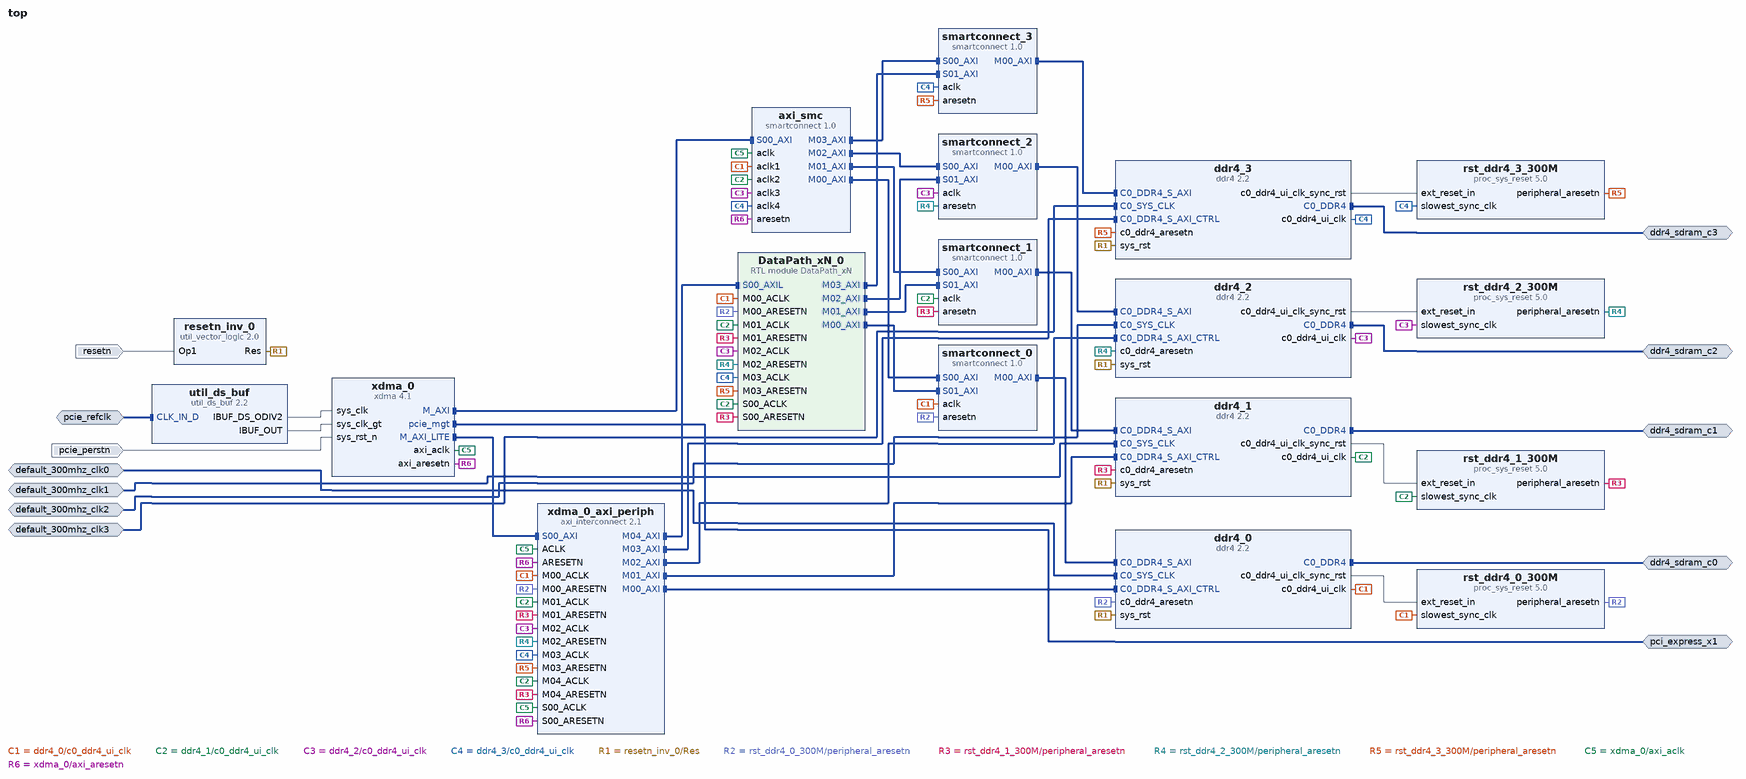
[diagram p0: block diagram of the top level]
# Vivado block design top, xcu250-figd2104-2L-e, Vivado 2022.2
create_bd_design top

create_bd_intf_port -mode Master -vlnv xilinx.com:interface:pcie_7x_mgt_rtl:1.0 pci_express_x1
create_bd_intf_port -mode Slave -vlnv xilinx.com:interface:diff_clock_rtl:1.0 pcie_refclk
set_property -dict {CONFIG.FREQ_HZ 100000000} [get_bd_intf_ports pcie_refclk]
create_bd_intf_port -mode Master -vlnv xilinx.com:interface:ddr4_rtl:1.0 ddr4_sdram_c0
create_bd_intf_port -mode Slave -vlnv xilinx.com:interface:diff_clock_rtl:1.0 default_300mhz_clk0
set_property -dict {CONFIG.FREQ_HZ 300000000} [get_bd_intf_ports default_300mhz_clk0]
create_bd_intf_port -mode Master -vlnv xilinx.com:interface:ddr4_rtl:1.0 ddr4_sdram_c1
create_bd_intf_port -mode Slave -vlnv xilinx.com:interface:diff_clock_rtl:1.0 default_300mhz_clk1
set_property -dict {CONFIG.FREQ_HZ 300000000} [get_bd_intf_ports default_300mhz_clk1]
create_bd_intf_port -mode Master -vlnv xilinx.com:interface:ddr4_rtl:1.0 ddr4_sdram_c2
create_bd_intf_port -mode Slave -vlnv xilinx.com:interface:diff_clock_rtl:1.0 default_300mhz_clk2
set_property -dict {CONFIG.FREQ_HZ 300000000} [get_bd_intf_ports default_300mhz_clk2]
create_bd_intf_port -mode Master -vlnv xilinx.com:interface:ddr4_rtl:1.0 ddr4_sdram_c3
create_bd_intf_port -mode Slave -vlnv xilinx.com:interface:diff_clock_rtl:1.0 default_300mhz_clk3
set_property -dict {CONFIG.FREQ_HZ 300000000} [get_bd_intf_ports default_300mhz_clk3]
create_bd_port -dir I -type rst pcie_perstn
set_property -dict {CONFIG.POLARITY ACTIVE_LOW} [get_bd_ports pcie_perstn]
create_bd_port -dir I -type rst resetn
set_property -dict {CONFIG.POLARITY ACTIVE_LOW} [get_bd_ports resetn]

create_bd_cell -type ip -vlnv xilinx.com:ip:xdma:4.1 xdma_0
set_property -dict [list \
  CONFIG.PCIE_BOARD_INTERFACE pci_express_x1 \
  CONFIG.SYS_RST_N_BOARD_INTERFACE pcie_perstn \
  CONFIG.axilite_master_en true \
  CONFIG.axilite_master_size 1 \
  CONFIG.pciebar2axibar_axil_master 0x00000000 \
  CONFIG.pl_link_cap_max_link_speed 2.5_GT/s \
  CONFIG.xdma_axi_intf_mm AXI_Memory_Mapped \
  CONFIG.xdma_rnum_chnl 1 \
  CONFIG.xdma_wnum_chnl 1 \
] [get_bd_cells xdma_0]
create_bd_cell -type ip -vlnv xilinx.com:ip:util_ds_buf:2.2 util_ds_buf
set_property -dict {CONFIG.DIFF_CLK_IN_BOARD_INTERFACE pcie_refclk CONFIG.USE_BOARD_FLOW true} [get_bd_cells util_ds_buf]
create_bd_cell -type ip -vlnv xilinx.com:ip:ddr4:2.2 ddr4_0
set_property -dict [list \
  CONFIG.ADDN_UI_CLKOUT1_FREQ_HZ None \
  CONFIG.C0_CLOCK_BOARD_INTERFACE default_300mhz_clk0 \
  CONFIG.C0_DDR4_BOARD_INTERFACE ddr4_sdram_c0 \
  CONFIG.RESET_BOARD_INTERFACE resetn \
] [get_bd_cells ddr4_0]
create_bd_cell -type ip -vlnv xilinx.com:ip:ddr4:2.2 ddr4_1
set_property -dict [list \
  CONFIG.ADDN_UI_CLKOUT1_FREQ_HZ None \
  CONFIG.C0_CLOCK_BOARD_INTERFACE default_300mhz_clk1 \
  CONFIG.C0_DDR4_BOARD_INTERFACE ddr4_sdram_c1 \
  CONFIG.RESET_BOARD_INTERFACE Custom \
] [get_bd_cells ddr4_1]
create_bd_cell -type ip -vlnv xilinx.com:ip:ddr4:2.2 ddr4_2
set_property -dict [list \
  CONFIG.ADDN_UI_CLKOUT1_FREQ_HZ None \
  CONFIG.C0_CLOCK_BOARD_INTERFACE default_300mhz_clk2 \
  CONFIG.C0_DDR4_BOARD_INTERFACE ddr4_sdram_c2 \
  CONFIG.RESET_BOARD_INTERFACE Custom \
] [get_bd_cells ddr4_2]
create_bd_cell -type ip -vlnv xilinx.com:ip:ddr4:2.2 ddr4_3
set_property -dict [list \
  CONFIG.ADDN_UI_CLKOUT1_FREQ_HZ None \
  CONFIG.C0_CLOCK_BOARD_INTERFACE default_300mhz_clk3 \
  CONFIG.C0_DDR4_BOARD_INTERFACE ddr4_sdram_c3 \
  CONFIG.RESET_BOARD_INTERFACE Custom \
] [get_bd_cells ddr4_3]
create_bd_cell -type ip -vlnv xilinx.com:ip:smartconnect:1.0 axi_smc
set_property -dict {CONFIG.NUM_CLKS 5 CONFIG.NUM_MI 4 CONFIG.NUM_SI 1} [get_bd_cells axi_smc]
create_bd_cell -type ip -vlnv xilinx.com:ip:proc_sys_reset:5.0 rst_ddr4_0_300M
create_bd_cell -type ip -vlnv xilinx.com:ip:axi_interconnect:2.1 xdma_0_axi_periph
set_property -dict {CONFIG.NUM_MI 5 CONFIG.S00_HAS_DATA_FIFO 2 CONFIG.STRATEGY 2} [get_bd_cells xdma_0_axi_periph]
create_bd_cell -type ip -vlnv xilinx.com:ip:proc_sys_reset:5.0 rst_ddr4_1_300M
create_bd_cell -type ip -vlnv xilinx.com:ip:proc_sys_reset:5.0 rst_ddr4_2_300M
create_bd_cell -type ip -vlnv xilinx.com:ip:proc_sys_reset:5.0 rst_ddr4_3_300M
create_bd_cell -type ip -vlnv xilinx.com:ip:smartconnect:1.0 smartconnect_0
set_property -dict {CONFIG.NUM_SI 2} [get_bd_cells smartconnect_0]
create_bd_cell -type ip -vlnv xilinx.com:ip:smartconnect:1.0 smartconnect_1
set_property -dict {CONFIG.NUM_SI 2} [get_bd_cells smartconnect_1]
create_bd_cell -type ip -vlnv xilinx.com:ip:smartconnect:1.0 smartconnect_2
set_property -dict {CONFIG.NUM_SI 2} [get_bd_cells smartconnect_2]
create_bd_cell -type ip -vlnv xilinx.com:ip:smartconnect:1.0 smartconnect_3
set_property -dict {CONFIG.NUM_SI 2} [get_bd_cells smartconnect_3]
create_bd_cell -type ip -vlnv xilinx.com:ip:util_vector_logic:2.0 resetn_inv_0
set_property -dict {CONFIG.C_OPERATION not CONFIG.C_SIZE 1} [get_bd_cells resetn_inv_0]
create_bd_cell -type module -reference DataPath_xN DataPath_xN_0

# ---- connections ----

connect_bd_intf_net [get_bd_intf_pins DataPath_xN_0/M00_AXI] [get_bd_intf_pins smartconnect_0/S01_AXI]
connect_bd_intf_net [get_bd_intf_pins DataPath_xN_0/M01_AXI] [get_bd_intf_pins smartconnect_1/S01_AXI]
connect_bd_intf_net [get_bd_intf_pins DataPath_xN_0/M02_AXI] [get_bd_intf_pins smartconnect_2/S01_AXI]
connect_bd_intf_net [get_bd_intf_pins DataPath_xN_0/M03_AXI] [get_bd_intf_pins smartconnect_3/S01_AXI]
connect_bd_intf_net [get_bd_intf_pins axi_smc/M00_AXI] [get_bd_intf_pins smartconnect_0/S00_AXI]
connect_bd_intf_net [get_bd_intf_pins axi_smc/M01_AXI] [get_bd_intf_pins smartconnect_1/S00_AXI]
connect_bd_intf_net [get_bd_intf_pins axi_smc/M02_AXI] [get_bd_intf_pins smartconnect_2/S00_AXI]
connect_bd_intf_net [get_bd_intf_pins axi_smc/M03_AXI] [get_bd_intf_pins smartconnect_3/S00_AXI]
connect_bd_intf_net [get_bd_intf_ports ddr4_sdram_c0] [get_bd_intf_pins ddr4_0/C0_DDR4]
connect_bd_intf_net [get_bd_intf_ports ddr4_sdram_c1] [get_bd_intf_pins ddr4_1/C0_DDR4]
connect_bd_intf_net [get_bd_intf_ports ddr4_sdram_c2] [get_bd_intf_pins ddr4_2/C0_DDR4]
connect_bd_intf_net [get_bd_intf_ports ddr4_sdram_c3] [get_bd_intf_pins ddr4_3/C0_DDR4]
connect_bd_intf_net -intf_net default_300mhz_clk0_1 [get_bd_intf_ports default_300mhz_clk0] [get_bd_intf_pins ddr4_0/C0_SYS_CLK]
connect_bd_intf_net -intf_net default_300mhz_clk1_1 [get_bd_intf_ports default_300mhz_clk1] [get_bd_intf_pins ddr4_1/C0_SYS_CLK]
connect_bd_intf_net -intf_net default_300mhz_clk2_1 [get_bd_intf_ports default_300mhz_clk2] [get_bd_intf_pins ddr4_2/C0_SYS_CLK]
connect_bd_intf_net -intf_net default_300mhz_clk3_1 [get_bd_intf_ports default_300mhz_clk3] [get_bd_intf_pins ddr4_3/C0_SYS_CLK]
connect_bd_intf_net [get_bd_intf_ports pcie_refclk] [get_bd_intf_pins util_ds_buf/CLK_IN_D]
connect_bd_intf_net [get_bd_intf_pins smartconnect_0/M00_AXI] [get_bd_intf_pins ddr4_0/C0_DDR4_S_AXI]
connect_bd_intf_net [get_bd_intf_pins smartconnect_1/M00_AXI] [get_bd_intf_pins ddr4_1/C0_DDR4_S_AXI]
connect_bd_intf_net [get_bd_intf_pins smartconnect_2/M00_AXI] [get_bd_intf_pins ddr4_2/C0_DDR4_S_AXI]
connect_bd_intf_net [get_bd_intf_pins smartconnect_3/M00_AXI] [get_bd_intf_pins ddr4_3/C0_DDR4_S_AXI]
connect_bd_intf_net [get_bd_intf_pins xdma_0/M_AXI] [get_bd_intf_pins axi_smc/S00_AXI]
connect_bd_intf_net [get_bd_intf_pins xdma_0/M_AXI_LITE] [get_bd_intf_pins xdma_0_axi_periph/S00_AXI]
connect_bd_intf_net [get_bd_intf_pins xdma_0_axi_periph/M00_AXI] [get_bd_intf_pins ddr4_0/C0_DDR4_S_AXI_CTRL]
connect_bd_intf_net [get_bd_intf_pins xdma_0_axi_periph/M01_AXI] [get_bd_intf_pins ddr4_1/C0_DDR4_S_AXI_CTRL]
connect_bd_intf_net [get_bd_intf_pins xdma_0_axi_periph/M02_AXI] [get_bd_intf_pins ddr4_2/C0_DDR4_S_AXI_CTRL]
connect_bd_intf_net [get_bd_intf_pins xdma_0_axi_periph/M03_AXI] [get_bd_intf_pins ddr4_3/C0_DDR4_S_AXI_CTRL]
connect_bd_intf_net [get_bd_intf_pins xdma_0_axi_periph/M04_AXI] [get_bd_intf_pins DataPath_xN_0/S00_AXIL]
connect_bd_intf_net [get_bd_intf_ports pci_express_x1] [get_bd_intf_pins xdma_0/pcie_mgt]
connect_bd_net [get_bd_pins ddr4_0/c0_ddr4_ui_clk] \
  [get_bd_pins axi_smc/aclk1] [get_bd_pins rst_ddr4_0_300M/slowest_sync_clk] [get_bd_pins xdma_0_axi_periph/M00_ACLK] \
  [get_bd_pins smartconnect_0/aclk] [get_bd_pins DataPath_xN_0/M00_ACLK]
connect_bd_net [get_bd_pins ddr4_0/c0_ddr4_ui_clk_sync_rst] [get_bd_pins rst_ddr4_0_300M/ext_reset_in]
connect_bd_net [get_bd_pins ddr4_1/c0_ddr4_ui_clk] \
  [get_bd_pins axi_smc/aclk2] [get_bd_pins rst_ddr4_1_300M/slowest_sync_clk] [get_bd_pins xdma_0_axi_periph/M01_ACLK] \
  [get_bd_pins smartconnect_1/aclk] [get_bd_pins xdma_0_axi_periph/M04_ACLK] [get_bd_pins DataPath_xN_0/M01_ACLK] \
  [get_bd_pins DataPath_xN_0/S00_ACLK]
connect_bd_net [get_bd_pins ddr4_1/c0_ddr4_ui_clk_sync_rst] [get_bd_pins rst_ddr4_1_300M/ext_reset_in]
connect_bd_net [get_bd_pins ddr4_2/c0_ddr4_ui_clk] \
  [get_bd_pins axi_smc/aclk3] [get_bd_pins rst_ddr4_2_300M/slowest_sync_clk] [get_bd_pins xdma_0_axi_periph/M02_ACLK] \
  [get_bd_pins smartconnect_2/aclk] [get_bd_pins DataPath_xN_0/M02_ACLK]
connect_bd_net [get_bd_pins ddr4_2/c0_ddr4_ui_clk_sync_rst] [get_bd_pins rst_ddr4_2_300M/ext_reset_in]
connect_bd_net [get_bd_pins ddr4_3/c0_ddr4_ui_clk] \
  [get_bd_pins axi_smc/aclk4] [get_bd_pins rst_ddr4_3_300M/slowest_sync_clk] [get_bd_pins xdma_0_axi_periph/M03_ACLK] \
  [get_bd_pins smartconnect_3/aclk] [get_bd_pins DataPath_xN_0/M03_ACLK]
connect_bd_net [get_bd_pins ddr4_3/c0_ddr4_ui_clk_sync_rst] [get_bd_pins rst_ddr4_3_300M/ext_reset_in]
connect_bd_net [get_bd_ports pcie_perstn] [get_bd_pins xdma_0/sys_rst_n]
connect_bd_net [get_bd_ports resetn] [get_bd_pins resetn_inv_0/Op1]
connect_bd_net [get_bd_pins resetn_inv_0/Res] \
  [get_bd_pins ddr4_0/sys_rst] [get_bd_pins ddr4_3/sys_rst] [get_bd_pins ddr4_1/sys_rst] [get_bd_pins ddr4_2/sys_rst]
connect_bd_net [get_bd_pins rst_ddr4_0_300M/peripheral_aresetn] \
  [get_bd_pins ddr4_0/c0_ddr4_aresetn] [get_bd_pins xdma_0_axi_periph/M00_ARESETN] [get_bd_pins smartconnect_0/aresetn] \
  [get_bd_pins DataPath_xN_0/M00_ARESETN]
connect_bd_net [get_bd_pins rst_ddr4_1_300M/peripheral_aresetn] \
  [get_bd_pins ddr4_1/c0_ddr4_aresetn] [get_bd_pins xdma_0_axi_periph/M01_ARESETN] [get_bd_pins smartconnect_1/aresetn] \
  [get_bd_pins xdma_0_axi_periph/M04_ARESETN] [get_bd_pins DataPath_xN_0/M01_ARESETN] [get_bd_pins DataPath_xN_0/S00_ARESETN]
connect_bd_net [get_bd_pins rst_ddr4_2_300M/peripheral_aresetn] \
  [get_bd_pins ddr4_2/c0_ddr4_aresetn] [get_bd_pins xdma_0_axi_periph/M02_ARESETN] [get_bd_pins smartconnect_2/aresetn] \
  [get_bd_pins DataPath_xN_0/M02_ARESETN]
connect_bd_net [get_bd_pins rst_ddr4_3_300M/peripheral_aresetn] \
  [get_bd_pins ddr4_3/c0_ddr4_aresetn] [get_bd_pins xdma_0_axi_periph/M03_ARESETN] [get_bd_pins smartconnect_3/aresetn] \
  [get_bd_pins DataPath_xN_0/M03_ARESETN]
connect_bd_net [get_bd_pins util_ds_buf/IBUF_DS_ODIV2] [get_bd_pins xdma_0/sys_clk]
connect_bd_net [get_bd_pins util_ds_buf/IBUF_OUT] [get_bd_pins xdma_0/sys_clk_gt]
connect_bd_net [get_bd_pins xdma_0/axi_aclk] [get_bd_pins axi_smc/aclk] [get_bd_pins xdma_0_axi_periph/ACLK] [get_bd_pins xdma_0_axi_periph/S00_ACLK]
connect_bd_net [get_bd_pins xdma_0/axi_aresetn] \
  [get_bd_pins axi_smc/aresetn] [get_bd_pins xdma_0_axi_periph/S00_ARESETN] [get_bd_pins xdma_0_axi_periph/ARESETN]

# ---- address map ----
assign_bd_address -offset 0x00000000 -range 4G -target_address_space [get_bd_addr_spaces DataPath_xN_0/M00_AXI] [get_bd_addr_segs ddr4_0/C0_DDR4_MEMORY_MAP/C0_DDR4_ADDRESS_BLOCK]
assign_bd_address -offset 0x00000000 -range 4G -target_address_space [get_bd_addr_spaces DataPath_xN_0/M01_AXI] [get_bd_addr_segs ddr4_1/C0_DDR4_MEMORY_MAP/C0_DDR4_ADDRESS_BLOCK]
assign_bd_address -offset 0x00000000 -range 4G -target_address_space [get_bd_addr_spaces DataPath_xN_0/M02_AXI] [get_bd_addr_segs ddr4_2/C0_DDR4_MEMORY_MAP/C0_DDR4_ADDRESS_BLOCK]
assign_bd_address -offset 0x00000000 -range 4G -target_address_space [get_bd_addr_spaces DataPath_xN_0/M03_AXI] [get_bd_addr_segs ddr4_3/C0_DDR4_MEMORY_MAP/C0_DDR4_ADDRESS_BLOCK]
assign_bd_address -offset 0x0000000000000000 -range 16G -target_address_space [get_bd_addr_spaces xdma_0/M_AXI] [get_bd_addr_segs ddr4_0/C0_DDR4_MEMORY_MAP/C0_DDR4_ADDRESS_BLOCK]
assign_bd_address -offset 0x0000000400000000 -range 16G -target_address_space [get_bd_addr_spaces xdma_0/M_AXI] [get_bd_addr_segs ddr4_1/C0_DDR4_MEMORY_MAP/C0_DDR4_ADDRESS_BLOCK]
assign_bd_address -offset 0x0000000800000000 -range 16G -target_address_space [get_bd_addr_spaces xdma_0/M_AXI] [get_bd_addr_segs ddr4_2/C0_DDR4_MEMORY_MAP/C0_DDR4_ADDRESS_BLOCK]
assign_bd_address -offset 0x0000000C00000000 -range 16G -target_address_space [get_bd_addr_spaces xdma_0/M_AXI] [get_bd_addr_segs ddr4_3/C0_DDR4_MEMORY_MAP/C0_DDR4_ADDRESS_BLOCK]
assign_bd_address -offset 0x00000000 -range 8K -target_address_space [get_bd_addr_spaces xdma_0/M_AXI_LITE] [get_bd_addr_segs DataPath_xN_0/S00_AXIL/reg0]
assign_bd_address -offset 0x80000000 -range 1M -target_address_space [get_bd_addr_spaces xdma_0/M_AXI_LITE] [get_bd_addr_segs ddr4_0/C0_DDR4_MEMORY_MAP_CTRL/C0_REG]
assign_bd_address -offset 0x80100000 -range 1M -target_address_space [get_bd_addr_spaces xdma_0/M_AXI_LITE] [get_bd_addr_segs ddr4_1/C0_DDR4_MEMORY_MAP_CTRL/C0_REG]
assign_bd_address -offset 0x80200000 -range 1M -target_address_space [get_bd_addr_spaces xdma_0/M_AXI_LITE] [get_bd_addr_segs ddr4_2/C0_DDR4_MEMORY_MAP_CTRL/C0_REG]
assign_bd_address -offset 0x80300000 -range 1M -target_address_space [get_bd_addr_spaces xdma_0/M_AXI_LITE] [get_bd_addr_segs ddr4_3/C0_DDR4_MEMORY_MAP_CTRL/C0_REG]

validate_bd_design
save_bd_design
